# EAGLE design board (EAGLE 7.7.0)
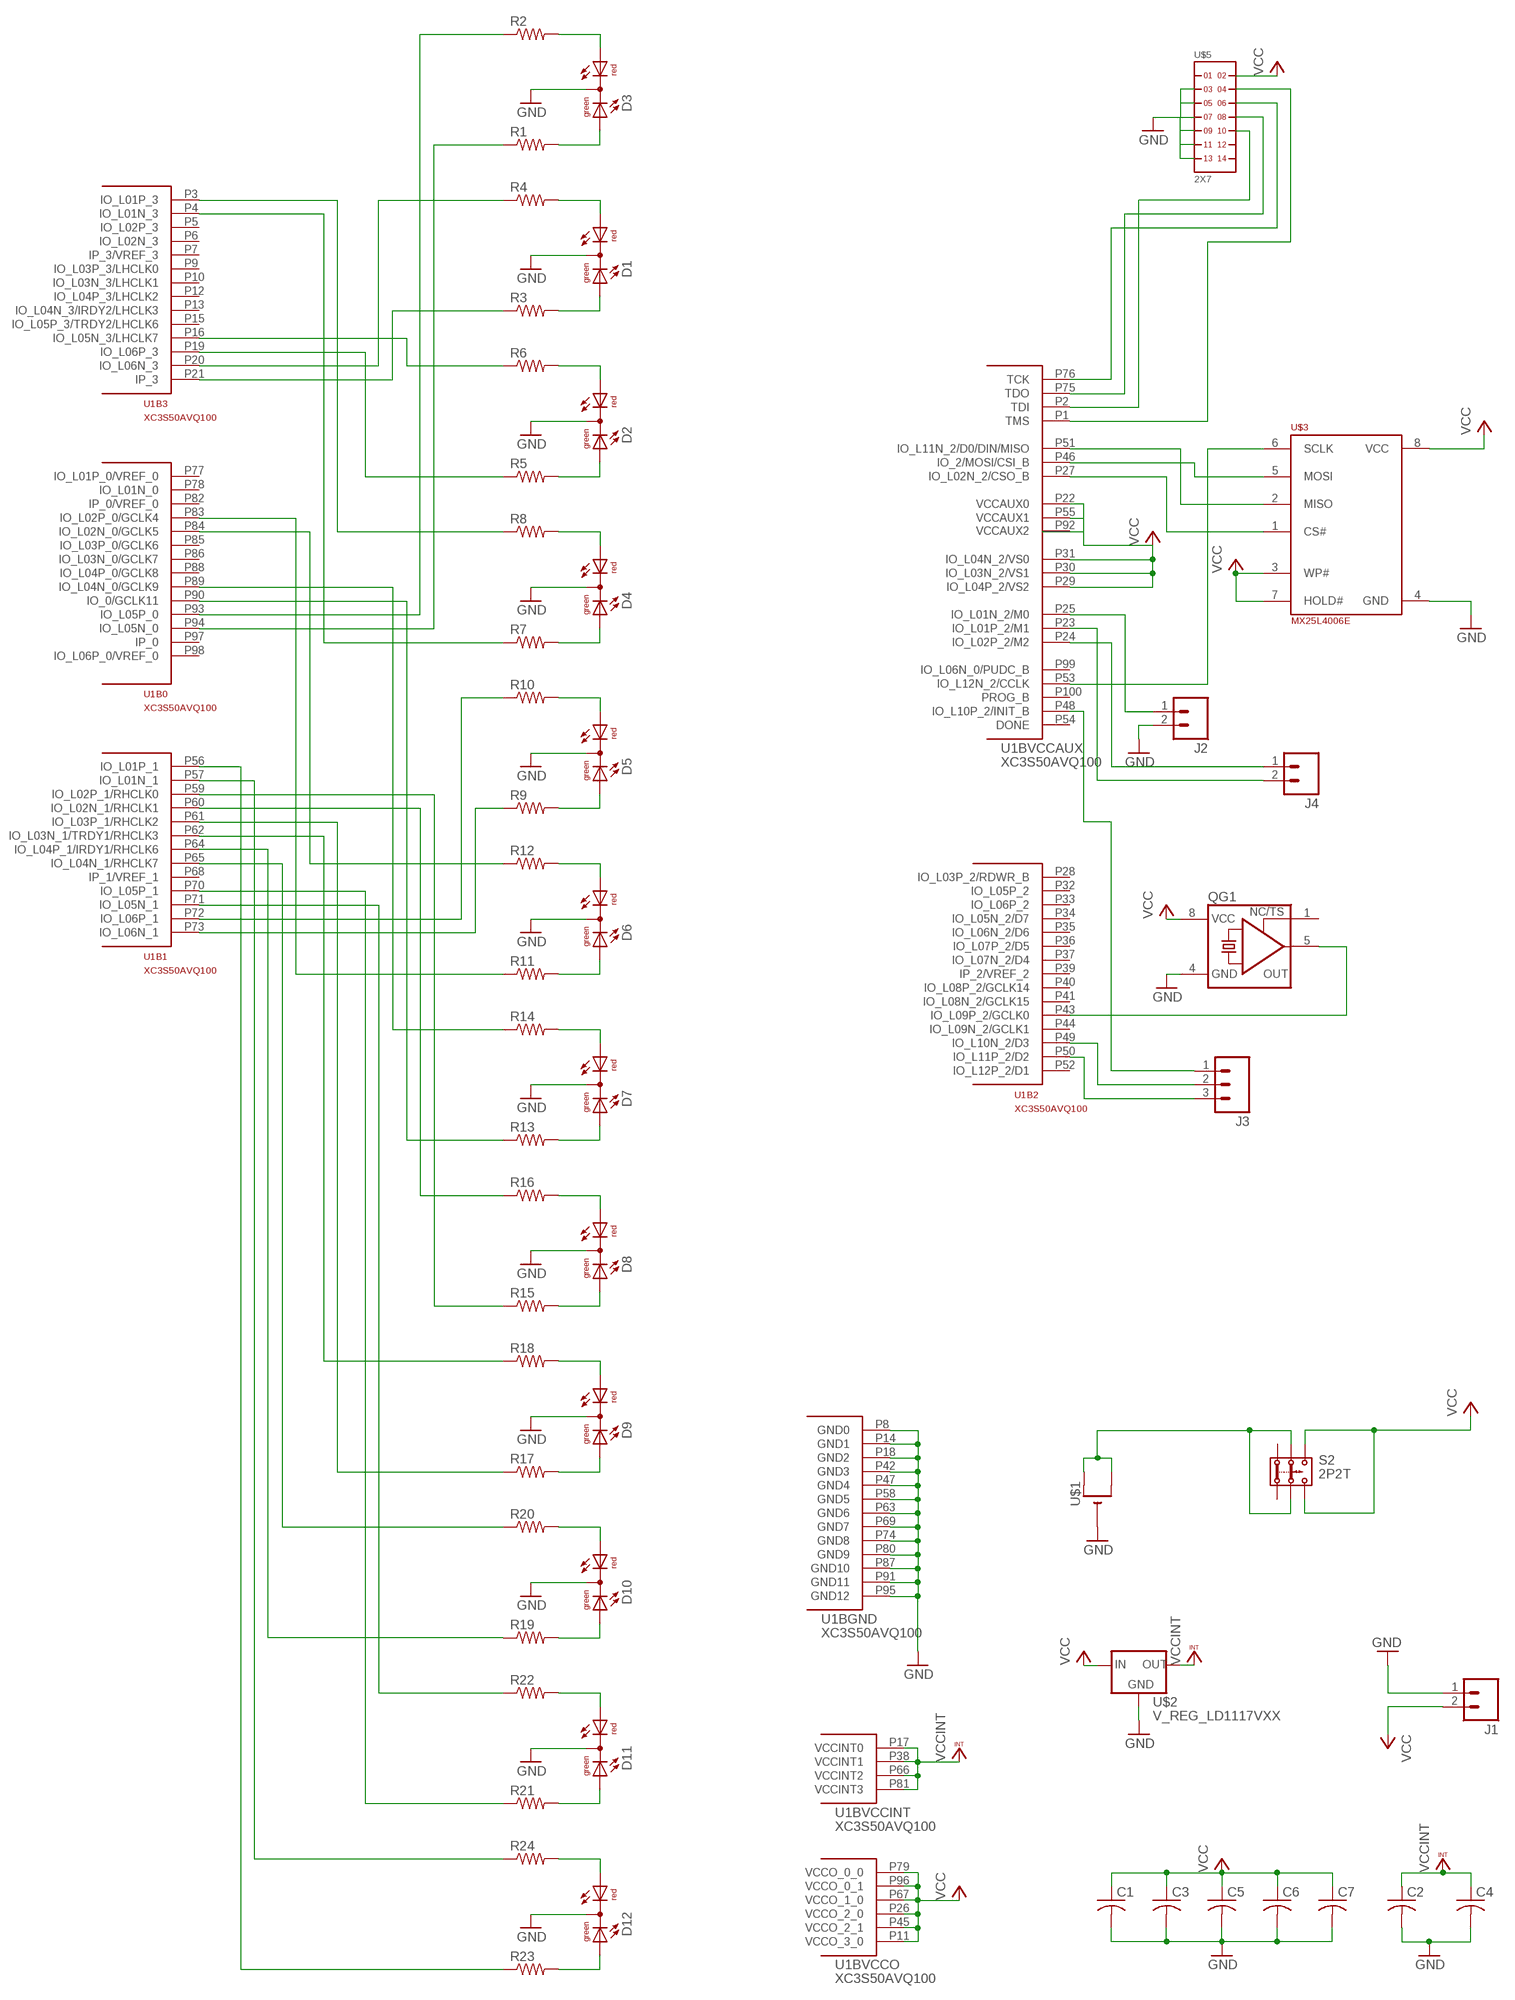
[diagram p0: schematic, sheet 1]

## Parts
C1  C-USC0805  [C0805]
C2  C-USC0805  [C0805]
C3  C-USC0805  [C0805]
C4  C-USC0805  [C0805]
C5  C-USC0805  [C0805]
C6  C-USC0805  [C0805]
C7  C-USC0805  [C0805]
D1  DUOLED5MM  [DUOLED5MM]
D2  DUOLED5MM  [DUOLED5MM]
D3  DUOLED5MM  [DUOLED5MM]
D4  DUOLED5MM  [DUOLED5MM]
D5  DUOLED5MM  [DUOLED5MM]
D6  DUOLED5MM  [DUOLED5MM]
D7  DUOLED5MM  [DUOLED5MM]
D8  DUOLED5MM  [DUOLED5MM]
D9  DUOLED5MM  [DUOLED5MM]
D10  DUOLED5MM  [DUOLED5MM]
D11  DUOLED5MM  [DUOLED5MM]
D12  DUOLED5MM  [DUOLED5MM]
J1  M02LOCK  [1X02_LOCK]
J2  M02LOCK  [1X02_LOCK]
J3  M03LOCK  [1X03_LOCK]
J4  M02LOCK  [1X02_LOCK]
QG1  XO-8  [DIL08S]
R1  R-US_0204/7  [0204/7]
R2  R-US_0204/7  [0204/7]
R3  R-US_0204/7  [0204/7]
R4  R-US_0204/7  [0204/7]
R5  R-US_0204/7  [0204/7]
R6  R-US_0204/7  [0204/7]
R7  R-US_0204/7  [0204/7]
R8  R-US_0204/7  [0204/7]
R9  R-US_0204/7  [0204/7]
R10  R-US_0204/7  [0204/7]
R11  R-US_0204/7  [0204/7]
R12  R-US_0204/7  [0204/7]
R13  R-US_0204/7  [0204/7]
R14  R-US_0204/7  [0204/7]
R15  R-US_0204/7  [0204/7]
R16  R-US_0204/7  [0204/7]
R17  R-US_0204/7  [0204/7]
R18  R-US_0204/7  [0204/7]
R19  R-US_0204/7  [0204/7]
R20  R-US_0204/7  [0204/7]
R21  R-US_0204/7  [0204/7]
R22  R-US_0204/7  [0204/7]
R23  R-US_0204/7  [0204/7]
R24  R-US_0204/7  [0204/7]
S2  2P2T  [2P2T]
U1  XC3S50AVQ100  [VQ100]
U$1  CR2032THM  [CR2032-THRU]
U$2  V_REG_LD1117VXX  [78XXL]
U$3  MX25L4006E  [DIL08]
U$5  2X7  [2X7]

## Nets
CLK: QG1.5(OUT) U1.P43(B2:IO_L09P_2/GCLK0)
GND: C1.2 C2.2 C3.2 C4.2 C5.2 C6.2 C7.2 D1.K(C) D2.K(C) D3.K(C) D4.K(C) D5.K(C) D6.K(C) D7.K(C) D8.K(C) D9.K(C) D10.K(C) D11.K(C) D12.K(C) J1.1 J2.2 QG1.4(GND) U1.P8(BGND:GND0) U1.P14(BGND:GND1) U1.P18(BGND:GND2) U1.P42(BGND:GND3) U1.P47(BGND:GND4) U1.P58(BGND:GND5) U1.P63(BGND:GND6) U1.P69(BGND:GND7) U1.P74(BGND:GND8) U1.P80(BGND:GND9) U1.P87(BGND:GND10) U1.P91(BGND:GND11) U1.P95(BGND:GND12) U$1.- U$2.IN(GND) U$3.4(GND) U$5.3 U$5.5 U$5.7 U$5.9 U$5.11 U$5.13
N$1: U1.P1(BVCCAUX:TMS) U$5.4
N$2: S2.2.1 S2.2.2 U$1.+1(+) U$1.+2(+1)
N$3: D1.AR R4.2
N$4: D3.AR R2.2
N$5: D1.AG R3.2
N$6: D2.AR R6.2
N$7: D2.AG R5.2
N$8: D4.AR R8.2
N$9: D3.AG R1.2
N$10: D4.AG R7.2
N$11: D5.AR R10.2
N$12: D5.AG R9.2
N$13: D6.AR R12.2
N$14: D6.AG R11.2
N$15: D7.AR R14.2
N$16: D7.AG R13.2
N$17: D8.AR R16.2
N$18: D8.AG R15.2
N$19: D9.AR R18.2
N$20: D9.AG R17.2
N$21: D10.AR R20.2
N$22: D10.AG R19.2
N$23: D11.AR R22.2
N$24: D11.AG R21.2
N$25: D12.AR R24.2
N$26: D12.AG R23.2
N$27: U1.P2(BVCCAUX:TDI) U$5.10
N$28: U1.P75(BVCCAUX:TDO) U$5.8
N$29: U1.P76(BVCCAUX:TCK) U$5.6
N$30: J3.3 U1.P50(B2:IO_L11P_2/D2)
N$31: J3.2 U1.P49(B2:IO_L10N_2/D3)
N$32: J3.1 U1.P48(BVCCAUX:IO_L10P_2/INIT_B)
N$33: U1.P51(BVCCAUX:IO_L11N_2/D0/DIN/MISO) U$3.2(MISO)
N$34: U1.P46(BVCCAUX:IO_2/MOSI/CSI_B) U$3.5(MOSI)
N$35: U1.P27(BVCCAUX:IO_L02N_2/CSO_B) U$3.1(CS#)
N$36: U1.P53(BVCCAUX:IO_L12N_2/CCLK) U$3.6(SCLK)
N$37: J4.1 U1.P24(BVCCAUX:IO_L02P_2/M2)
N$38: J4.2 U1.P23(BVCCAUX:IO_L01P_2/M1)
N$39: R3.1 U1.P21(B3:IP_3)
N$40: R4.1 U1.P20(B3:IO_L06N_3)
N$41: R5.1 U1.P19(B3:IO_L06P_3)
N$42: R6.1 U1.P16(B3:IO_L05N_3/LHCLK7)
N$43: R7.1 U1.P4(B3:IO_L01N_3)
N$44: R8.1 U1.P3(B3:IO_L01P_3)
N$45: R2.1 U1.P93(B0:IO_L05P_0)
N$46: R1.1 U1.P94(B0:IO_L05N_0)
N$47: R13.1 U1.P90(B0:IO_0/GCLK11)
N$48: R14.1 U1.P89(B0:IO_L04N_0/GCLK9)
N$49: R12.1 U1.P84(B0:IO_L02N_0/GCLK5)
N$50: R11.1 U1.P83(B0:IO_L02P_0/GCLK4)
N$51: R10.1 U1.P72(B1:IO_L06P_1)
N$52: R9.1 U1.P73(B1:IO_L06N_1)
N$53: R22.1 U1.P71(B1:IO_L05N_1)
N$54: R21.1 U1.P70(B1:IO_L05P_1)
N$55: R20.1 U1.P65(B1:IO_L04N_1/RHCLK7)
N$56: R19.1 U1.P64(B1:IO_L04P_1/IRDY1/RHCLK6)
N$57: R18.1 U1.P62(B1:IO_L03N_1/TRDY1/RHCLK3)
N$58: R17.1 U1.P61(B1:IO_L03P_1/RHCLK2)
N$59: R16.1 U1.P60(B1:IO_L02N_1/RHCLK1)
N$60: R15.1 U1.P59(B1:IO_L02P_1/RHCLK0)
N$61: R24.1 U1.P57(B1:IO_L01N_1)
N$62: R23.1 U1.P56(B1:IO_L01P_1)
N$63: J2.1 U1.P25(BVCCAUX:IO_L01N_2/M0)
VCC: C1.1 C3.1 C5.1 C6.1 C7.1 J1.2 QG1.8(VCC) S2.3.1 S2.3.2 U1.P11(BVCCO:VCCO_3_0) U1.P22(BVCCAUX:VCCAUX0) U1.P26(BVCCO:VCCO_2_0) U1.P29(BVCCAUX:IO_L04P_2/VS2) U1.P30(BVCCAUX:IO_L03N_2/VS1) U1.P31(BVCCAUX:IO_L04N_2/VS0) U1.P45(BVCCO:VCCO_2_1) U1.P55(BVCCAUX:VCCAUX1) U1.P67(BVCCO:VCCO_1_0) U1.P79(BVCCO:VCCO_0_0) U1.P96(BVCCO:VCCO_0_1) U$2.OUT(IN) U$3.3(WP#) U$3.7(HOLD#) U$3.8(VCC) U$5.2
VCCINT: C2.1 C4.1 U1.P17(BVCCINT:VCCINT0) U1.P38(BVCCINT:VCCINT1) U1.P66(BVCCINT:VCCINT2) U1.P81(BVCCINT:VCCINT3) U$2.GND(OUT)
Unconnected: QG1.1(TS) S2.1.1 S2.1.2 U1.P5(B3:IO_L02P_3) U1.P6(B3:IO_L02N_3) U1.P7(B3:IP_3/VREF_3) U1.P9(B3:IO_L03P_3/LHCLK0) U1.P10(B3:IO_L03N_3/LHCLK1) U1.P12(B3:IO_L04P_3/LHCLK2) U1.P13(B3:IO_L04N_3/IRDY2/LHCLK3) U1.P15(B3:IO_L05P_3/TRDY2/LHCLK6) U1.P28(B2:IO_L03P_2/RDWR_B) U1.P32(B2:IO_L05P_2) U1.P33(B2:IO_L06P_2) U1.P34(B2:IO_L05N_2/D7) U1.P35(B2:IO_L06N_2/D6) U1.P36(B2:IO_L07P_2/D5) U1.P37(B2:IO_L07N_2/D4) U1.P39(B2:IP_2/VREF_2) U1.P40(B2:IO_L08P_2/GCLK14) U1.P41(B2:IO_L08N_2/GCLK15) U1.P44(B2:IO_L09N_2/GCLK1) U1.P52(B2:IO_L12P_2/D1) U1.P54(BVCCAUX:DONE) U1.P68(B1:IP_1/VREF_1) U1.P77(B0:IO_L01P_0/VREF_0) U1.P78(B0:IO_L01N_0) U1.P82(B0:IP_0/VREF_0) U1.P85(B0:IO_L03P_0/GCLK6) U1.P86(B0:IO_L03N_0/GCLK7) U1.P88(B0:IO_L04P_0/GCLK8) U1.P92(BVCCAUX:VCCAUX2) U1.P97(B0:IP_0) U1.P98(B0:IO_L06P_0/VREF_0) U1.P99(BVCCAUX:IO_L06N_0/PUDC_B) U1.P100(BVCCAUX:PROG_B) U$5.1 U$5.12 U$5.14

## Library data of the parts
C1-C7 = rcl:C-US: CAPACITOR, American symbol
D1-D12 = led:DUOLED5MM: DUO LED 2 colors, 5 mm, round
J1 J2 J4 = SparkFun-Connectors:M02: Standard 2-pin 0.1" header. Use with - straight break away headers ( PRT-00116) - right angle break away headers (PRT-00553) - swiss pins (PRT-00743) - machine pins (PRT-00117) - female headers (PRT-00115) Molex polarized connector foot print use with: PRT-08233 with associated crimp pins and housings. 2.54_SCREWTERM for use with PRT-10571. 3.5mm Screw Terminal footprints for PRT-08084 5mm Screw Terminal footprints for use with PRT-08432
J3 = SparkFun-Connectors:M03: Header 3 Standard 3-pin 0.1" header. Use with straight break away headers (SKU : PRT-00116), right angle break away headers (PRT-00553), swiss pins (PRT-00743), machine pins (PRT-00117), and female headers (PRT-00115). Molex polarized connector foot print use with SKU : PRT-08232 with associated crimp pins and housings.
QG1 = crystal:XO-: CRYSTAL; OC_FARNELL: unknown; OC_NEWARK: unknown
R1-R24 = rcl:R-US_: RESISTOR, American symbol
S2 = switch:2P2T: SLIDE SWITCH 2P2T Part No. SS-22F05-G(A)4 Source: CANAL ELECTRONIC CO., LTD .. switsch.pdf
U1 = xilinx_spartan3a:XC3S50AVQ100: Xilinx FPGA
U$1 = adafruit:CR2032
U$2 = SparkFun-PowerIC:V_REG_LD1117VXX: LD1117VXX voltage regulator. We carry the 3.3V version (COM-00526) in TO-220 package.
U$3 = custom_parts_for_xmas_card:MX25L4006E
U$5 = headers(2mm):2X7

## Board
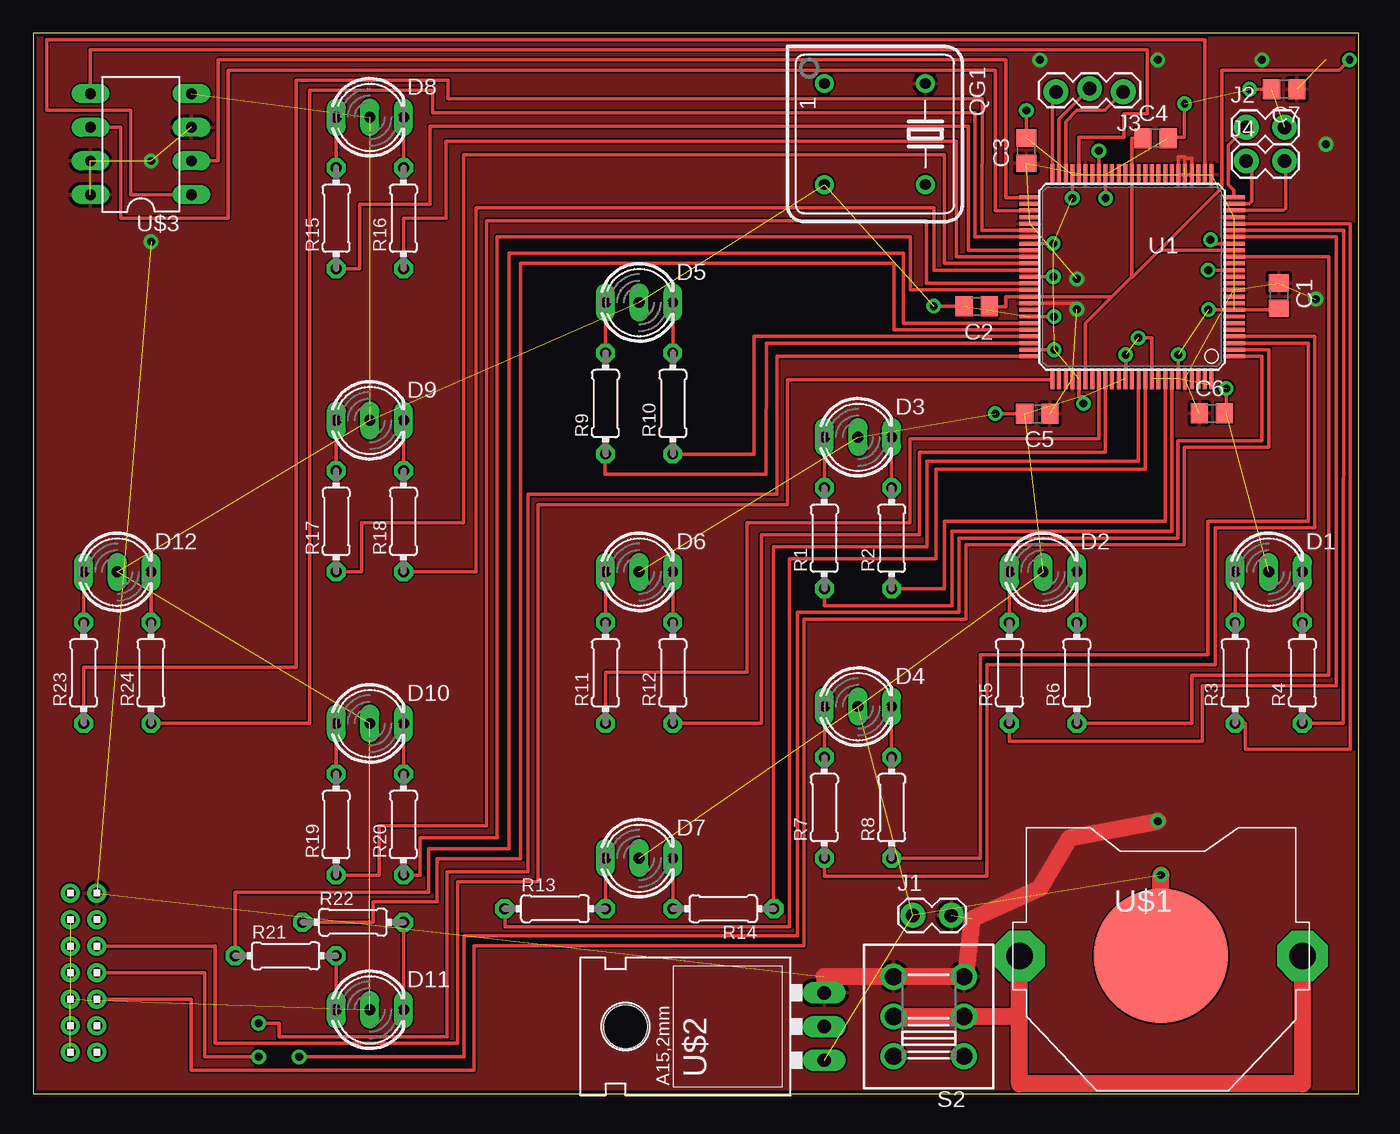
[diagram p1: board, top side]
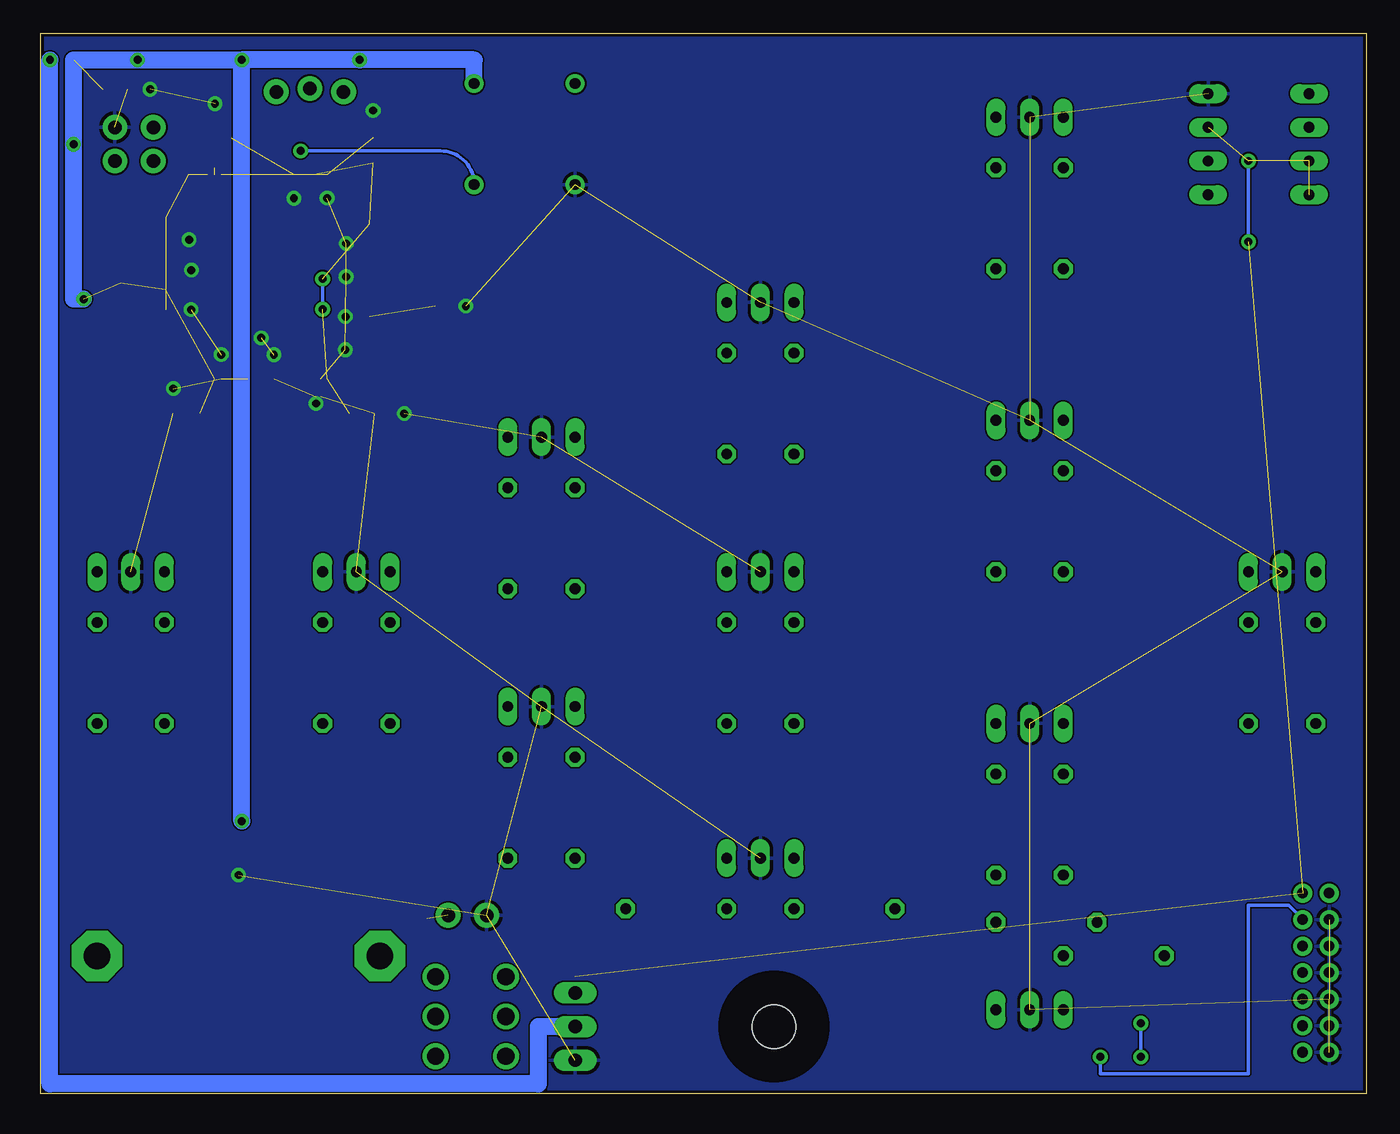
[diagram p2: board, bottom side, seen from below]

Size 100 x 80 mm. Coordinates in mm from the lower left corner, seen from the top.
Outline: 0,0 100,0 100,80 0,80 0,0
Copper layers (1*16): Top 0.035mm / dielectric 1.5mm / Bottom 0.035mm
Design rules "SparkFun *": minimum track width 8mil, minimum drill 20mil, track to track 5mil, track to pad 5mil, pad to pad 5mil, via to via 5mil, smd to smd 5mil, copper to edge 10mil, drill to drill 8mil, minimum pad ring 12mil, minimum via ring 10mil, stop-mask expansion 4mil, vias tented up to drill 25mil, thermal gap 10mil

### Footprints (pad centres in the part's own frame; a part is rotated, then mirrored left to right if it is on the bottom)
C0805 = smd 1.3 x 1.5: 1 -0.95,0; 2 0.95,0
DUOLED5MM = drill 0.813 long: AG -2.54,0; AR 2.54,0; K 0,0
1X02_LOCK = drill 1.016 pad 1.88: 1 -0.178,0; 2 2.718,0
1X03_LOCK = drill 1.016 pad 1.88: 1 0,0.127; 2 2.54,-0.127; 3 5.08,0.127
DIL08S = drill 0.813: 1 -3.81,-3.81; 4 3.81,-3.81; 5 3.81,3.81; 8 -3.81,3.81
0204/7 = drill 0.813 octagon: 1 -3.81,0; 2 3.81,0
2P2T = drill 1.3 pad 1.93: 1.1 -3,2.65; 1.2 -3,-2.65; 2.1 0,2.65; 2.2 0,-2.65; 3.1 3,2.65; 3.2 3,-2.65
VQ100 = smd 1.6 x 0.3: P1 -7.7,6; P2 -7.7,5.5; P3 -7.7,5; P4 -7.7,4.5; P5 -7.7,4; P6 -7.7,3.5; P7 -7.7,3; P8 -7.7,2.5; P9 -7.7,2; P10 -7.7,1.5; P11 -7.7,1; P12 -7.7,0.5; P13 -7.7,0; P14 -7.7,-0.5; P15 -7.7,-1; P16 -7.7,-1.5; P17 -7.7,-2; P18 -7.7,-2.5; P19 -7.7,-3; P20 -7.7,-3.5; P21 -7.7,-4; P22 -7.7,-4.5; P23 -7.7,-5; P24 -7.7,-5.5; P25 -7.7,-6; P51 7.7,-6; P52 7.7,-5.5; P53 7.7,-5; P54 7.7,-4.5; P55 7.7,-4; P56 7.7,-3.5; P57 7.7,-3; P58 7.7,-2.5; P59 7.7,-2; P60 7.7,-1.5; P61 7.7,-1; P62 7.7,-0.5; P63 7.7,0; P64 7.7,0.5; P65 7.7,1; P66 7.7,1.5; P67 7.7,2; P68 7.7,2.5; P69 7.7,3; P70 7.7,3.5; P71 7.7,4; P72 7.7,4.5; P73 7.7,5; P74 7.7,5.5; P75 7.7,6 | smd 0.3 x 1.6: P26 -6,-7.7; P27 -5.5,-7.7; P28 -5,-7.7; P29 -4.5,-7.7; P30 -4,-7.7; P31 -3.5,-7.7; P32 -3,-7.7; P33 -2.5,-7.7; P34 -2,-7.7; P35 -1.5,-7.7; P36 -1,-7.7; P37 -0.5,-7.7; P38 0,-7.7; P39 0.5,-7.7; P40 1,-7.7; P41 1.5,-7.7; P42 2,-7.7; P43 2.5,-7.7; P44 3,-7.7; P45 3.5,-7.7; P46 4,-7.7; P47 4.5,-7.7; P48 5,-7.7; P49 5.5,-7.7; P50 6,-7.7; P76 6,7.7; P77 5.5,7.7; P78 5,7.7; P79 4.5,7.7; P80 4,7.7; P81 3.5,7.7; P82 3,7.7; P83 2.5,7.7; P84 2,7.7; P85 1.5,7.7; P86 1,7.7; P87 0.5,7.7; P88 0,7.7; P89 -0.5,7.7; P90 -1,7.7; P91 -1.5,7.7; P92 -2,7.7; P93 -2.5,7.7; P94 -3,7.7; P95 -3.5,7.7; P96 -4,7.7; P97 -4.5,7.7; P98 -5,7.7; P99 -5.5,7.7; P100 -6,7.7
CR2032-THRU = drill 2 pad 3.81 octagon: +1 -10.668,0; +2 10.668,0 | smd 10.16 x 10.16: - 0,0
78XXL = drill 1.016 long: GND 0,-3.81; IN -2.54,-3.81; OUT 2.54,-3.81 | hole 3.302: 0,11.176
DIL08 = drill 0.813 long: 1 -3.81,-3.81; 2 -1.27,-3.81; 3 1.27,-3.81; 4 3.81,-3.81; 5 3.81,3.81; 6 1.27,3.81; 7 -1.27,3.81; 8 -3.81,3.81
2X7 = drill 0.8 pad 1.422: 1 -6,-1; 2 -6,1; 3 -4,-1; 4 -4,1; 5 -2,-1; 6 -2,1; 7 0,-1; 8 0,1; 9 2,-1; 10 2,1; 11 4,-1; 12 4,1; 13 6,-1; 14 6,1

### Placement (x,y rotation side)
C1  93.98,60.2 270 top
C2  71.2,59.39 180 top
C3  74.92,71.15 90 top
C4  84.68,72.07 0 top
C5  75.75,51.29 180 top
C6  88.92,51.32 0 top
C7  94.38,75.78 180 top
D1  93.22,39.37 0 top
D2  76.2,39.37 0 top
D3  62.23,49.53 0 top
D4  62.23,29.21 0 top
D5  45.72,59.69 0 top
D6  45.72,39.37 0 top
D7  45.72,17.78 0 top
D8  25.4,73.66 0 top
D9  25.4,50.8 0 top
D10  25.4,27.94 0 top
D11  25.4,6.35 0 top
D12  6.35,39.37 0 top
J1  66.55,13.46 0 top
J2  91.69,72.9 0 top
J3  82.25,75.7 180 top
J4  91.69,70.36 0 top
QG1  63.5,72.39 270 top
R1  59.69,41.91 90 top
R2  64.77,41.91 90 top
R3  90.68,31.75 90 top
R4  95.76,31.75 90 top
R5  73.66,31.75 90 top
R6  78.74,31.75 90 top
R7  59.69,21.59 90 top
R8  64.77,21.59 90 top
R9  43.18,52.07 90 top
R10  48.26,52.07 90 top
R11  43.18,31.75 90 top
R12  48.26,31.75 90 top
R13  39.37,13.97 0 top
R14  52.07,13.97 180 top
R15  22.86,66.04 90 top
R16  27.94,66.04 90 top
R17  22.86,43.18 90 top
R18  27.94,43.18 90 top
R19  22.86,20.32 90 top
R20  27.94,20.32 90 top
R21  19.05,10.41 0 top
R22  24.13,12.95 0 top
R23  3.81,31.75 90 top
R24  8.89,31.75 90 top
S2  67.56,5.84 90 top
U1  82.9,61.63 180 top
U$1  85.09,10.41 0 top
U$2  55.88,5.08 90 top
U$3  8.13,71.63 90 top
U$5  3.81,9.14 270 top

### Tracks (layer width: path | path; a pad name or v marks a point on that pad's centre or on a via)
CLK  (via drill 0.6)
  Top 0.254: U1.P43 v80.4,71.12
  Bottom 0.254: QG1.5 arc-90 69.85,71.12 v80.4,71.12
GND  (via drill 0.6)  (42 unrouted)
  Top 0.254: U1.P74 76.96,56.13 | 76.96,56.13 | U1.P63 v76.97,61.63 | v76.96,64.14 U1.P58 | U1.P69 v77.02,58.63 v77.02,58.62 | 76.96,56.13 v77.03,56.13 | U1.P80 78.9,52.58 79.25,52.58 v79.25,52.07 | U1.P87 82.42,53.93 v82.42,55.75 | U1.P91 84.4,57.03 v83.38,57.03 v83.38,57.02 | v86.4,55.76 U1.P95 | v88.67,59.15 90.6,59.15 U1.P8 93.98,59.13 C1.2 | U1.P14 v88.65,62.13 | v88.82,64.42 v88.81,64.42 88.81,64.12 U1.P18 | v80.91,67.55 v80.9,67.55 U1.P42 | U1.P47 v78.4,67.56 | C4.2 85.6,72.07 85.6,72.14 86.87,72.14 v86.87,74.68 | v67.94,59.42 70.25,59.42 C2.2 | C6.2 90.01,51.32 v90.01,53.2 | v72.58,51.31 74.8,51.31 C5.2 | C3.2 v74.93,74.17 | v91.76,75.77 C7.2
  Top 1.27: U$1.- v85.09,16.51
  pour Bottom: 0,80.01 0,0 100.33,0 100.33,80.01
N$1  (via drill 0.6)
  Top 0.254: v20.07,2.79 32.51,2.79 32.51,11.94 57.66,11.94 57.66,36.32 69.85,36.32 69.85,41.91 86.36,41.91 86.36,49.28 92.71,49.28 92.71,55.63 U1.P1
  Bottom 0.254: v20.07,2.79 20.07,1.52 8.89,1.52 8.89,14.22 5.84,14.22 4.81,13.19 U$5.4
N$2
  Top 1.27: S2.2.1 S2.2.2 74.42,5.84 | 74.42,5.84 74.42,0.76 95.76,0.76 U$1.+2 | 74.42,5.84 U$1.+1
N$3
  Top 0.254: D1.AR R4.2
N$4
  Top 0.254: D3.AR R2.2
N$5
  Top 0.254: D1.AG R3.2
N$6
  Top 0.254: D2.AR R6.2
N$7
  Top 0.254: D2.AG R5.2
N$8
  Top 0.254: D4.AR R8.2
N$9
  Top 0.254: D3.AG R1.2
N$10
  Top 0.254: D4.AG R7.2
N$11
  Top 0.254: D5.AR R10.2
N$12
  Top 0.254: R9.2 D5.AG
N$13
  Top 0.254: D6.AR R12.2
N$14
  Top 0.254: D6.AG R11.2
N$15
  Top 0.254: D7.AR R14.2
N$16
  Top 0.254: D7.AG R13.2
N$17
  Top 0.254: D8.AR R16.2
N$18
  Top 0.254: D8.AG R15.2
N$19
  Top 0.254: D9.AR R18.2
N$20
  Top 0.254: D9.AG R17.2
N$21
  Top 0.254: D10.AR R20.2
N$22
  Top 0.254: D10.AG R19.2
N$23
  Top 0.254: D11.AR R22.2
N$24
  Top 0.254: D11.AG R21.2
N$25
  Top 0.254: D12.AR R24.2
N$26
  Top 0.254: D12.AG R23.2
N$27
  Top 0.254: U1.P2 93.22,56.13 93.22,48.77 86.87,48.77 86.87,41.4 70.36,41.4 70.36,35.81 58.17,35.81 58.17,11.18 33.27,11.18 33.27,1.78 11.94,1.78 11.94,7.11 11.91,7.14 U$5.10
N$28  (via drill 0.6)
  Top 0.254: v17.02,2.79 12.95,2.79 12.95,9.14 U$5.8 | U1.P75 56.13,55.63 56.13,45.21 37.34,45.21 37.34,16.76 31.24,16.76 31.24,4.32 18.54,4.32 18.54,5.33 v17.02,5.33
  Bottom 0.254: v17.02,2.79 v17.02,5.33
N$29
  Top 0.254: U1.P76 76.9,53.85 56.9,53.85 56.9,44.45 38.1,44.45 38.1,16 32,16 32,3.81 13.72,3.81 13.72,11.18 13.68,11.14 U$5.6
N$30
  Top 0.254: U1.P50 76.9,75.31 J3.3
N$31
  Top 0.254: U1.P49 77.4,73.52 J3.2
N$32
  Top 0.254: U1.P48 77.9,73.33 78.74,74.17 80.84,74.17 J3.1
N$33
  Top 0.254: U$3.2 13.97,70.36 13.97,77.98 73.41,77.98 73.41,67.82 73.4,67.82 73.4,67.6 75.2,67.6 U1.P51
N$34
  Top 0.254: U$3.5 4.32,78.74 84.07,78.74 84.07,73.91 82.3,73.91 82.3,72.14 78.9,72.14 U1.P46
N$35
  Top 0.254: U$3.1 7.37,67.82 7.37,74.17 1.02,74.17 1.02,79.5 88.4,79.5 U1.P27
N$36
  Top 0.254: U$3.6 6.6,72.9 6.6,66.04 14.73,66.04 14.73,77.22 72.6,77.22 72.6,66.6 75.2,66.6 U1.P53
N$37
  Top 0.254: U1.P24 91.77,67.13 91.95,67.31 91.95,69.93 J4.1
N$38
  Top 0.254: U1.P23 94.32,66.63 94.49,66.8 94.49,70.28 J4.2
N$39
  Top 0.254: R3.1 91.45,27.94 91.45,26 99.36,26 99.37,65.63 U1.P21
N$40
  Top 0.254: R4.1 98.86,27.94 98.87,65.13 U1.P20
N$41
  Top 0.254: U1.P19 98.3,64.63 98.31,30.77 88.22,30.77 88.22,26.6 73.66,26.6 R5.1
N$42
  Top 0.254: R6.1 87.42,27.94 87.42,31.58 97.76,31.58 97.76,63.13 U1.P16
N$43
  Top 0.254: U1.P4 96.7,57.13 96.7,42.7 89.18,42.7 89.18,32.37 71.95,32.37 71.95,16.4 59.69,16.4 R7.1
N$44
  Top 0.254: R8.1 71.45,17.78 71.45,33.13 88.63,33.13 88.63,43.2 96.2,43.2 96.2,56.63 U1.P3
N$45
  Top 0.254: R2.1 68.75,38.1 68.75,43.2 85.4,43.2 U1.P93
N$46
  Top 0.254: R1.1 59.7,36.8 69.3,36.8 69.3,42.45 85.9,42.45 U1.P94
N$47
  Top 0.254: R13.1 35.6,13.97 35.6,12.61 57.05,12.61 57.05,40.36 68.1,40.36 68.1,47.1 83.9,47.1 U1.P90
N$48
  Top 0.254: R14.1 55.85,13.97 55.85,41.26 67.45,41.26 67.45,47.7 83.4,47.7 U1.P89
N$49
  Top 0.254: R12.1 54.95,27.94 54.95,42.16 66.85,42.16 66.85,48.4 80.9,48.4 U1.P84
N$50
  Top 0.254: R11.1 43.2,27.94 43.2,31.79 53.85,31.79 53.85,43.06 66.16,43.06 66.16,49.4 80.4,49.4 U1.P83
N$51
  Top 0.254: R10.1 54.4,48.26 54.39,57.13 U1.P72
N$52
  Top 0.254: R9.1 43.15,48.26 43.15,46.75 55.29,46.75 55.32,56.63 U1.P73
N$53
  Top 0.254: U1.P71 64.95,57.63 64.95,62.65 36.77,62.65 36.77,17.73 30.48,17.73 30.48,14.48 25.65,14.48 25.65,12.95 R22.1
N$54
  Top 0.254: U1.P70 65.65,58.13 65.65,63.4 35.92,63.4 35.92,18.48 29.84,18.48 29.84,15.2 15.24,15.2 R21.1
N$55
  Top 0.254: R20.1 29.19,16.51 29.19,19.33 35.02,19.33 35.02,64.65 66.2,64.65 66.19,60.63 U1.P65
N$56
  Top 0.254: R19.1 26.1,16.51 26.1,20.23 34.22,20.23 34.22,65.85 67.4,65.85 67.4,61.13 U1.P64
N$57
  Top 0.254: R18.1 33.43,39.37 33.43,66.85 67.95,66.85 67.95,62.13 U1.P62 75.2,62.1
N$58
  Top 0.254: R17.1 24.8,39.37 24.8,43.08 32.48,43.08 32.48,70.84 68.75,70.84 68.75,62.63 U1.P61
N$59
  Top 0.254: U1.P60 69.65,63.13 69.65,71.84 31.15,71.84 31.15,66.05 27.94,66.05 R16.1
N$60
  Top 0.254: R15.1 24.65,62.23 24.65,67.1 29.95,67.1 29.95,72.99 70.55,72.99 70.55,63.63 U1.P59
N$61
  Top 0.254: R24.1 20.85,27.94 20.85,75.7 30.15,75.7 30.15,73.99 71.05,73.99 71.05,64.63 U1.P57
N$62
  Top 0.254: U1.P56 71.59,65.13 71.6,75.05 31.3,75.05 31.3,76.45 19.85,76.45 19.85,32.18 3.81,32.18 R23.1
N$63
  Top 0.254: U1.P25 90.6,68.15 90.17,68.58 90.17,71.55 J2.1
VCC  (via drill 0.6)  (22 unrouted)
  Top 0.254: U1.P67 78.74,59.63 v78.74,59.18 | 86.9,70.56 87.4,70.56 U1.P29 U1.P31 | 86.9,70.56 86.9,69.84 | 86.9,70.56 86.9,70.66 86.4,70.66 86.4,69.85 86.41,69.85 U1.P31 | 86.41,69.24 U1.P31
  Top 1.27: U$2.OUT 59.69,8.84 S2.3.1 S2.3.2 70.36,8.84 70.87,13.21 75.95,15.49 78.23,19.3 v84.84,20.57
  Bottom 0.254: v78.74,61.47 v78.74,59.18 | v8.89,70.36 v8.89,64.26
  Bottom 1.27: v84.84,20.57 v84.84,77.98 | QG1.8 67.31,77.98 v75.95,77.98 v84.84,77.98 | v84.84,77.98 v92.71,77.98 97.54,77.98 v97.54,71.63 97.54,59.94 v96.77,59.94
  pour Top: 0,80.01 0,0 100.33,0 100.33,80.01
VCCINT  (via drill 0.6)
  Top 0.254: 82.9,61.63 82.89,65.62 82.9,67.1 U1.P38 82.9,72.07 C4.1 | 82.9,61.63 82.97,61.63 84.97,63.63 | 81.4,60.13 U1.P66 73.4,60.13 73.4,59.38 C2.1 | 81.4,60.13 82.9,61.63 | U1.P17 84.97,63.63 | U1.P81 79.4,58.13 81.4,60.13 | 84.97,63.63 89.66,68.33 89.66,77.22 98.55,77.22 v99.31,77.98
  Bottom 1.27: U$2.GND 62.48,5.08 62.48,0.76 99.31,0.76 v99.31,77.98